# EAGLE design fonte (EAGLE 9.6.2)
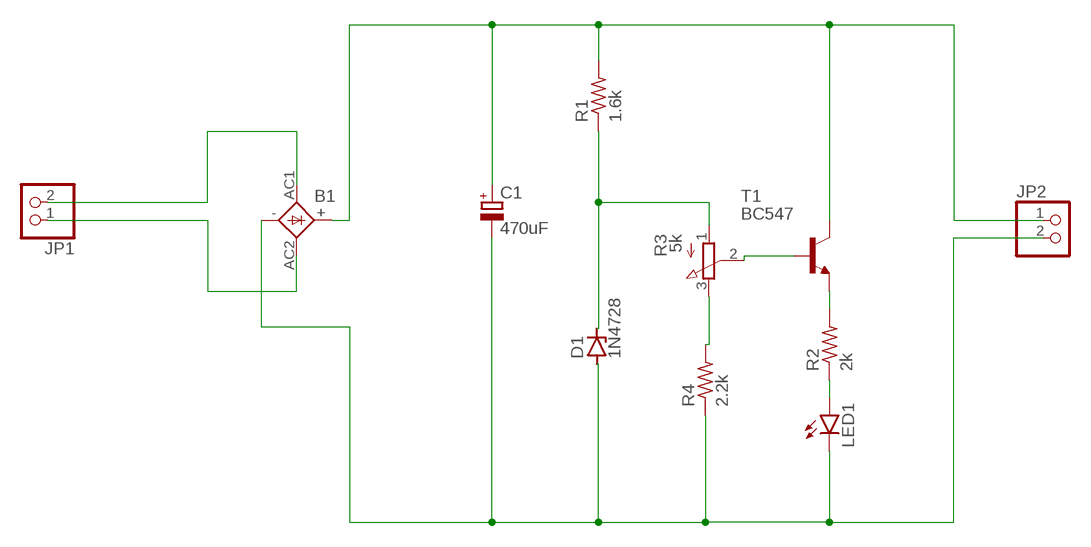
[diagram p0: schematic, sheet 1]

## Parts
B1  1KAB  [1KAB]
C1  470uF  CPOL-EUE5-10.5  [E5-10,5]
D1  1N4728  [DO41Z10]
JP1  PINHD-1X2  [1X02]
JP2  PINHD-1X2  [1X02]
LED1  LED5MM  [LED5MM]
R1  1.6k  R-US_0207/10  [0207/10]
R2  2k  R-US_0207/10  [0207/10]
R3  5k  3RP/1610N  [3RP/1610N]
R4  2.2k  R-US_0207/10  [0207/10]
T1  BC547  [TO92]

## Nets
N$1: B1.AC1 JP1.2
N$2: B1.AC2 JP1.1
N$3: B1.+ C1.+ JP2.1 R1.2 T1.3(C)
N$4: B1.- C1.- D1.A JP2.2 LED1.K(C) R4.1
N$5: D1.C R1.1 R3.1(A)
N$6: R3.3(E) R4.2
N$7: R3.2(S) T1.2(B)
N$8: R2.2 T1.1(E)
N$9: LED1.A R2.1

## Library data of the parts
B1 = rectifier:1KAB: RECTIFIER grid 5,08 x 5,08 mm
C1 = rcl:CPOL-EU: POLARIZED CAPACITOR, European symbol; SPICEPREFIX: C
D1 = diode:1N4728: Z DIODE 3.3 V, 1W, 5 percent
JP1 JP2 = pinhead:PINHD-1X2: PIN HEADER
LED1 = led:LED: LED OSRAM: - CHIPLED LG R971, LG N971, LY N971, LG Q971, LY Q971, LO R971, LY R971 LH N974, LH R974 LS Q976, LO Q976, LY Q976 LO Q996 - Hyper CHIPLED LW Q18S LB Q993, LB Q99A, LB R99A - SideLED LS A670, LO A670, LY A670, LG A670, LP A670 LB A673, LV A673, LT A673, LW A673 LH A674 LY A675 LS A676, LA A676, LO A676, LY A676, LW A676 LS A679, LY A679, LG A679 - Hyper Micro SIDELED® LS Y876, LA Y876, LO Y876, LY Y876 LT Y87S - SmartLED LW L88C, LW L88S LB L89C, LB L89S, LG L890 LS L89K, LO L89K, LY L89K LS L896, LA L896, LO L896, LY L896 - TOPLED LS T670, LO T670, LY T670, LG T670, LP T670 LSG T670, LSP T670, LSY T670, LOP T670, LYG T670 LG T671, LOG T671, LSG T671 LB T673, LV T673, LT T673, LW T673 LH T674 LS T676, LA T676, LO T676, LY T676, LB T676, LH T676, LSB T676, LW T676 LB T67C, LV T67C, LT T67C, LS T67K, LO T67K, LY T67K, LW E67C LS E67B, LA E67B, LO E67B, LY E67B, LB E67C, LV E67C, LT E67C LW T67C LS T679, LY T679, LG T679 LS T770, LO T770, LY T770, LG T770, LP T770 LB T773, LV T773, LT T773, LW T773 LH T774 LS E675, LA E675, LY E675, LS T675 LS T776, LA T776, LO T776, LY T776, LB T776 LHGB T686 LT T68C, LB T68C - Hyper Mini TOPLED® LB M676 - Mini TOPLED Santana® LG M470 LS M47K, LO M47K, LY M47K Source: http://www.osram.convergy.de LUXEON: - LUMILED® LXK2-PW12-R00, LXK2-PW12-S00, LXK2-PW14-U00, LXK2-PW14-V00 LXK2-PM12-R00, LXK2-PM12-S00, LXK2-PM14-U00 LXK2-PE12-Q00, LXK2-PE12-R00, LXK2-PE12-S00, LXK2-PE14-T00, LXK2-PE14-U00 LXK2-PB12-K00, LXK2-PB12-L00, LXK2-PB12-M00, LXK2-PB14-N00, LXK2-PB14-P00, LXK2-PB14-Q00 LXK2-PR12-L00, LXK2-PR12-M00, LXK2-PR14-Q00, LXK2-PR14-R00 LXK2-PD12-Q00, LXK2-PD12-R00, LXK2-PD12-S00 LXK2-PH12-R00, LXK2-PH12-S00 LXK2-PL12-P00, LXK2-PL12-Q00, LXK2-PL12-R00 Source: www.luxeon.com KINGBRIGHT: KA-3528ASYC Source: www.kingbright.com
R1 R2 R4 = rcl:R-US_: RESISTOR, American symbol; SPICEPREFIX: R
R3 = pot:3RP/1610N: 16mm Potentiometer one level Source: http://www.alphapotentiometers.net/html/16mm_pot_2.html
T1 = transistor:BC547: NPN TRANSISTOR

## Board
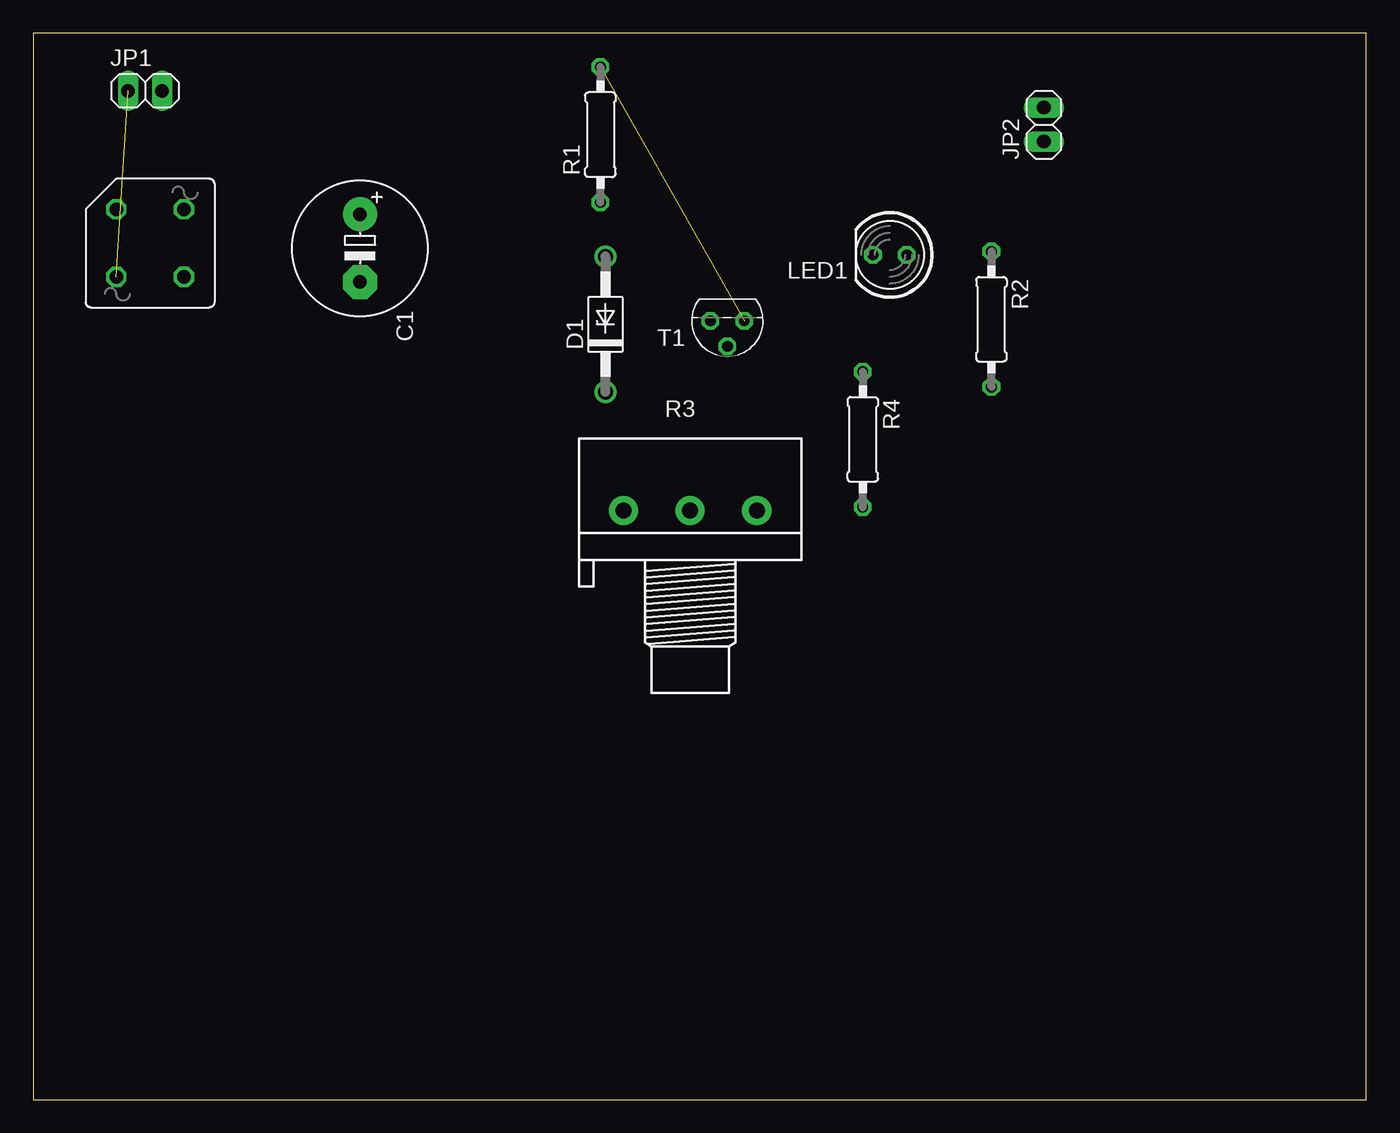
[diagram p1: board, top side]
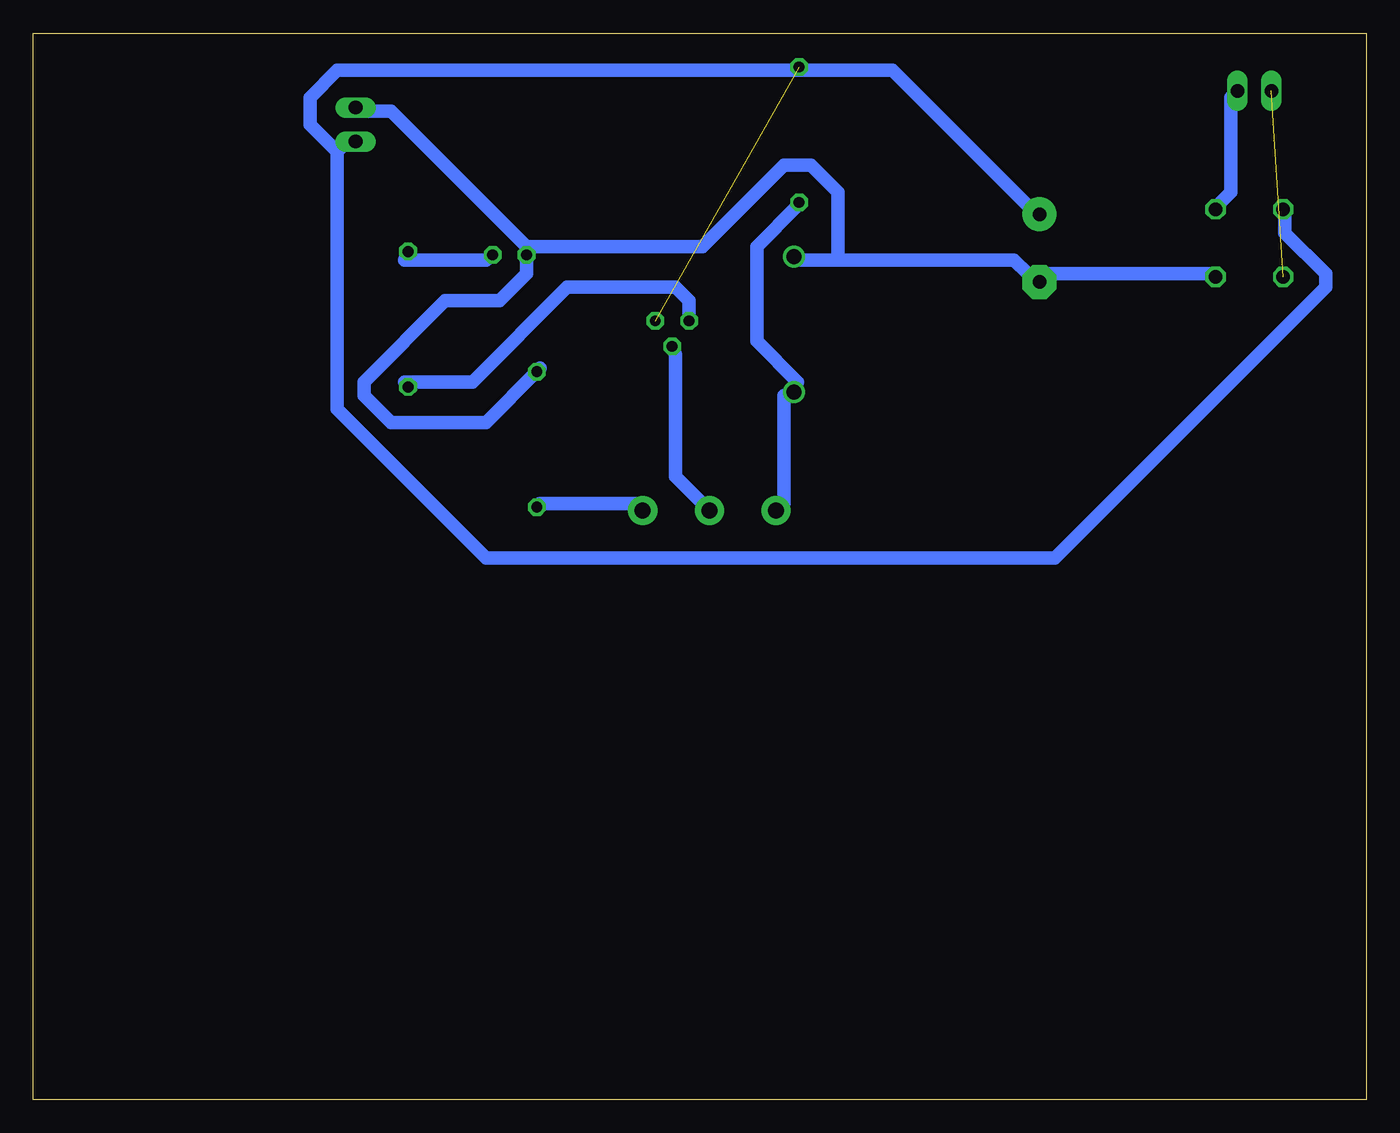
[diagram p2: board, bottom side, seen from below]

Size 100 x 80 mm. Coordinates in mm from the lower left corner, seen from the top.
Outline: 0,0 100,0 100,80 0,80 0,0
Copper layers (1*16): Top 0.035mm / dielectric 1.5mm / Bottom 0.035mm
Design rules "default *": minimum track width 40mil, minimum drill 0.35mm, track to track 40mil, track to pad 40mil, pad to pad 40mil, via to via 40mil, smd to smd 6mil, copper to edge 40mil, drill to drill 6mil, minimum pad ring 10mil, minimum via ring 8mil, stop-mask expansion 4mil, vias tented up to drill 0mil, thermal gap 10mil

### Footprints (pad centres in the part's own frame; a part is rotated, then mirrored left to right if it is on the bottom)
1KAB = drill 1.016 octagon: + 2.54,-2.54; - -2.54,2.54; AC1 -2.54,-2.54; AC2 2.54,2.54
E5-10,5 = drill 1.016 pad 2.54: + -2.54,0 | drill 1.016 pad 2.54 octagon: - 2.54,0
DO41Z10 = drill 1.118: A 5.08,0; C -5.08,0
1X02 = drill 1.016 long: 1 -1.27,0; 2 1.27,0
LED5MM = drill 0.813 octagon: A -1.27,0; K 1.27,0
0207/10 = drill 0.813 octagon: 1 -5.08,0; 2 5.08,0
3RP/1610N = drill 1.2 pad 2.184: 1 -5,0; 2 0,0; 3 5,0
TO92 = drill 0.813 octagon: 1 1.27,0; 2 0,1.905; 3 -1.27,0

### Placement (x,y rotation side)
B1  8.76,64.26 180 top
C1  24.51,63.88 270 top
D1  42.93,58.17 90 top
JP1  8.38,75.69 0 top
JP2  75.82,73.15 90 top
LED1  64.26,63.37 180 top
R1  42.55,72.39 90 top
R2  71.88,58.55 270 top
R3  49.28,44.2 0 top
R4  62.23,49.53 270 top
T1  52.07,58.42 180 top

### Tracks (layer width: path | path; a pad name or v marks a point on that pad's centre or on a via)
N$1
  Bottom 1.016: JP1.2 10.16,75.18 10.16,68.07 11.18,67.06 B1.AC1
N$2  (1 unrouted)
N$3  (1 unrouted)
  Bottom 1.016: 42.67,77.22 35.56,77.22 25.4,67.06 C1.+ | 77.22,71.12 77.22,51.82 66.04,40.64 23.37,40.64 3.05,60.96 3.05,61.98 6.1,65.02 6.1,67.06 B1.+ | 77.22,71.12 76.2,72.14 JP2.1 | 42.67,77.22 77.22,77.22 79.25,75.18 79.25,73.15 77.22,71.12 | 42.67,77.22 R1.2
N$4
  Bottom 1.016: 61.98,54.86 R4.1 66.04,50.8 73.15,50.8 75.18,52.83 75.18,53.85 69.09,59.94 65.02,59.94 62.99,61.98 LED1.K 62.99,64.01 | 62.99,64.01 73.15,74.17 75.18,74.17 JP2.2 | B1.- 11.18,61.98 24.38,61.98 C1.- 25.4,61.98 26.42,62.99 39.62,62.99 | 39.62,62.99 42.67,62.99 D1.A | 62.99,64.01 49.78,64.01 43.69,70.1 41.66,70.1 39.62,68.07 39.62,62.99
N$5
  Bottom 1.016: R1.1 42.67,67.06 45.72,64.01 45.72,56.9 42.67,53.85 D1.C 43.69,52.83 43.69,44.7 R3.1
N$6
  Bottom 1.016: R4.2 61.98,44.7 54.86,44.7 R3.3
N$7
  Bottom 1.016: R3.2 51.82,46.74 51.82,55.88 T1.2
N$8
  Bottom 1.016: T1.1 50.8,59.94 51.82,60.96 59.94,60.96 67.06,53.85 72.14,53.85 R2.2
N$9
  Bottom 1.016: LED1.A 66.04,62.99 72.14,62.99 R2.1